# Altium schematic sheet Tx_micro.SchDoc: Balise IR-Tx - Controleur
size A3; Author: B Labbe; CompanyName: Oufffteam; DrawnBy: B Labbe; Engineer: B Labbe; Organization: Oufffteam; Address1: L3, 12a Rodborough Rd; Address2: Frenchs Forest; Address3: NSW; Address4: Australia 2086; Revision: B; SheetNumber: 1; SheetTotal: 3; DocumentName: Balise IR-Tx - Controleur
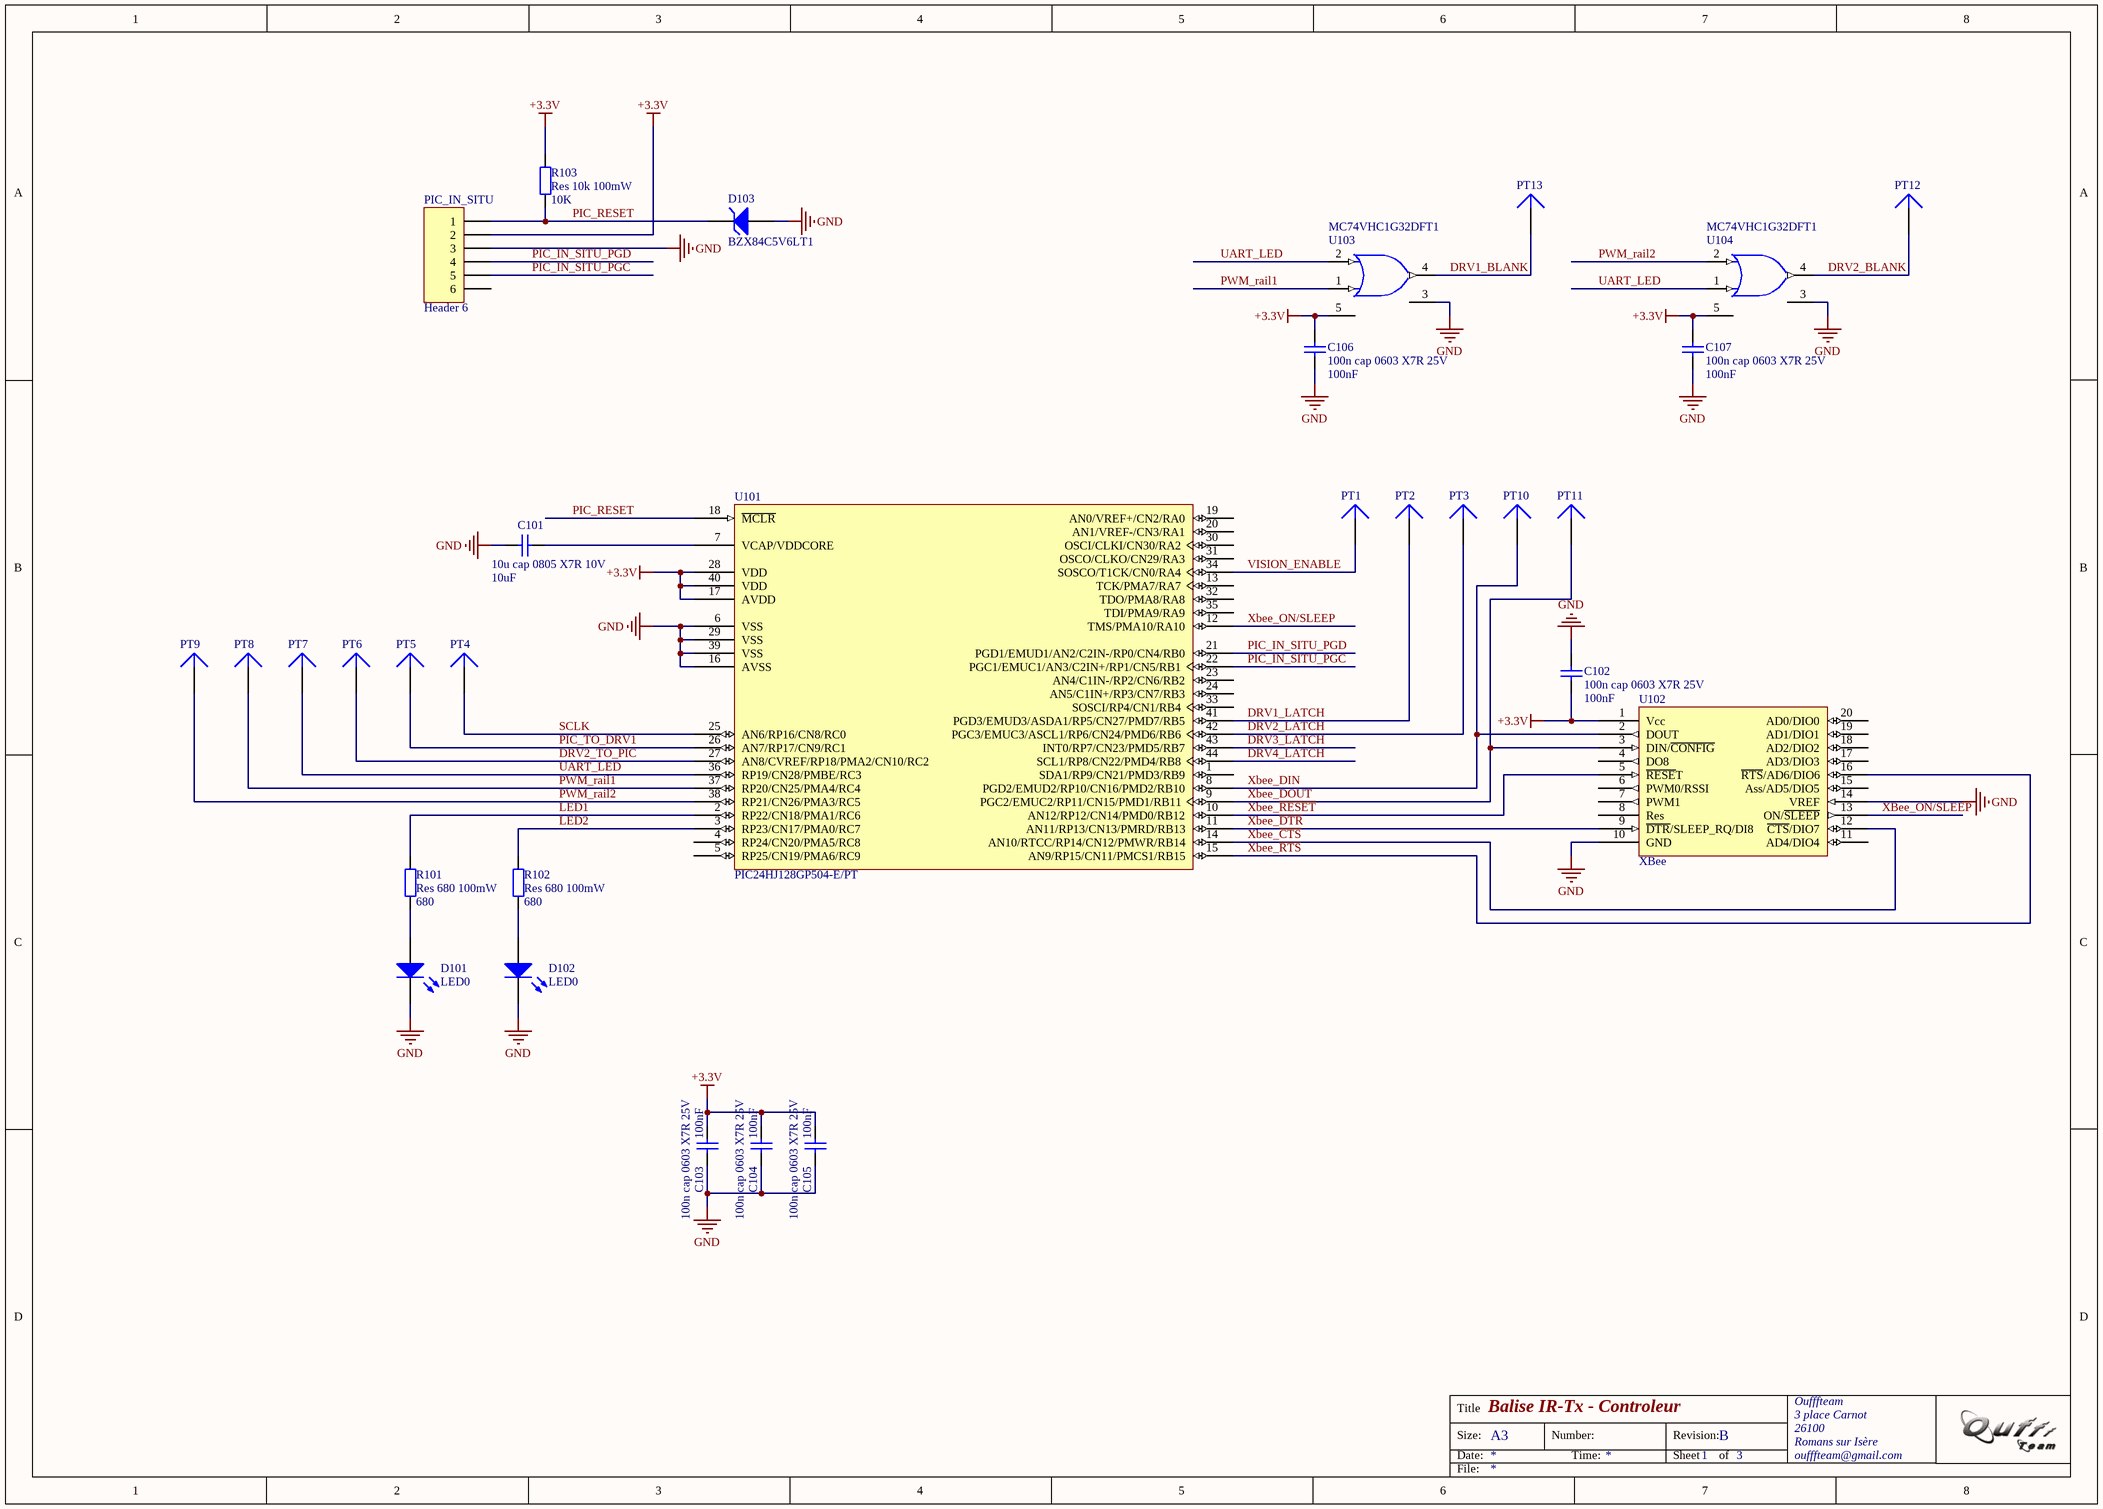
[diagram p0: Tx_micro.SchDoc]

## Parts
C101  10u cap 0805 X7R 10V  value 10uF  [0805]
C102  100n cap 0603 X7R 25V  value 100nF  [0603]
C103  100n cap 0603 X7R 25V  value 100nF  [0603]
C104  100n cap 0603 X7R 25V  value 100nF  [0603]
C105  100n cap 0603 X7R 25V  value 100nF  [0603]
C106  100n cap 0603 X7R 25V  value 100nF  [0603]
C107  100n cap 0603 X7R 25V  value 100nF  [0603]
D101  LED0  [0603]
D102  LED0  [0603]
D103  BZX84C5V6LT1  [318-07]
PIC_IN_SITU  Header 6  [HDR1X6]
PT1  Plug  [TP]  (value not drawn)
PT2  Plug  [TP]  (value not drawn)
PT3  Plug  [TP]  (value not drawn)
PT4  Plug  [TP]  (value not drawn)
PT5  Plug  [TP]  (value not drawn)
PT6  Plug  [TP]  (value not drawn)
PT7  Plug  [TP]  (value not drawn)
PT8  Plug  [TP]  (value not drawn)
PT9  Plug  [TP]  (value not drawn)
PT10  Plug  [TP]  (value not drawn)
PT11  Plug  [TP]  (value not drawn)
PT12  Plug  [TP]  (value not drawn)
PT13  Plug  [TP]  (value not drawn)
R101  Res 680 100mW  value 680  [0603]
R102  Res 680 100mW  value 680  [0603]
R103  Res 10k 100mW  value 10K  [0603]
U101  PIC24HJ128GP504-E/PT  [TQFP-PT44_L]
U102  XBee  [XBee_SM]
U103  MC74VHC1G32DFT1  [419A-01_L]
U104  MC74VHC1G32DFT1  [419A-01_L]

## Nets
+3.3V: C102.1 C103.2 C104.2 C105.2 C106.2 C107.2 PIC_IN_SITU.2 R103.2 U101.17(AVDD) U101.28(VDD) U101.40(VDD) U102.1(Vcc) U103.5(VDD) U104.5(VDD)  [also labelled VDD]
GND: C101.1 C102.2 C103.1 C104.1 C105.1 C106.1 C107.1 D101.2(K) D102.2(K) D103.1(A) PIC_IN_SITU.3 U101.6(VSS) U101.16(AVSS) U101.29(VSS) U101.39(VSS) U102.10(GND) U102.14(VREF) U103.3(GND) U104.3(GND)
DRV1_BLANK: PT13.1 U103.4(Y)
DRV1_LATCH: PT2.1 U101.41(PGD3/EMUD3/ASDA1/RP5/CN27/PMD7/RB5)
DRV2_BLANK: PT12.1 U104.4(Y)
DRV2_LATCH: PT3.1 U101.42(PGC3/EMUC3/ASCL1/RP6/CN24/PMD6/RB6)
DRV2_TO_PIC: PT6.1 U101.27(AN8/CVREF/RP18/PMA2/CN10/RC2)
DRV3_LATCH: U101.43(INT0/RP7/CN23/PMD5/RB7)
DRV4_LATCH: U101.44(SCL1/RP8/CN22/PMD4/RB8)
LED1: R101.2 U101.2(RP22/CN18/PMA1/RC6)
LED2: R102.2 U101.3(RP23/CN17/PMA0/RC7)
PIC_IN_SITU_PGC: PIC_IN_SITU.5 U101.22(PGC1/EMUC1/AN3/C2IN+/RP1/CN5/RB1)
PIC_IN_SITU_PGD: PIC_IN_SITU.4 U101.21(PGD1/EMUD1/AN2/C2IN-/RP0/CN4/RB0)
PIC_RESET: D103.3(K) PIC_IN_SITU.1 R103.1 U101.18(~{MCLR})
PIC_TO_DRV1: PT5.1 U101.26(AN7/RP17/CN9/RC1)
PWM_rail1: PT8.1 U101.37(RP20/CN25/PMA4/RC4) U103.1(IN_B)
PWM_rail2: PT9.1 U101.38(RP21/CN26/PMA3/RC5) U104.2(IN_A)
SCLK: PT4.1 U101.25(AN6/RP16/CN8/RC0)
UART_LED: PT7.1 U101.36(RP19/CN28/PMBE/RC3) U103.2(IN_A) U104.1(IN_B)
VISION_ENABLE: PT1.1 U101.34(SOSCO/T1CK/CN0/RA4)
Xbee_~{CTS}: U101.14(AN10/RTCC/RP14/CN12/PMWR/RB14) U102.12(~{CTS}/DIO7)
Xbee_~{DTR}: U101.11(AN11/RP13/CN13/PMRD/RB13) U102.9(~{DTR}/SLEEP_RQ/DI8)
Xbee_DIN: PT10.1 U101.8(PGD2/EMUD2/RP10/CN16/PMD2/RB10) U102.2(DOUT)
Xbee_DOUT: PT11.1 U101.9(PGC2/EMUC2/RP11/CN15/PMD1/RB11) U102.3(DIN/~{CONFIG})
XBee_ON/SLEEP: U101.12(TMS/PMA10/RA10) U102.13(ON/~{SLEEP})
Xbee_~{RESET}: U101.10(AN12/RP12/CN14/PMD0/RB12) U102.5(~{RESE}T)
Xbee_~{RTS}: U101.15(AN9/RP15/CN11/PMCS1/RB15) U102.16(~{RTS}/AD6/DIO6)
NetC101_2: C101.2 U101.7(VCAP/VDDCORE)
NetD101_1: D101.1(A) R101.1
NetD102_1: D102.1(A) R102.1

Not connected (* = marked no-connect by the designer): PIC_IN_SITU 6; U101 1(SDA1/RP9/CN21/PMD3/RB9) 4(RP24/CN20/PMA5/RC8) 5(RP25/CN19/PMA6/RC9) 13(TCK/PMA7/RA7) 19(AN0/VREF+/CN2/RA0) 20(AN1/VREF-/CN3/RA1) 23(AN4/C1IN-/RP2/CN6/RB2) 24(AN5/C1IN+/RP3/CN7/RB3) 30(OSCI/CLKI/CN30/RA2) 31(OSCO/CLKO/CN29/RA3) 32(TDO/PMA8/RA8) 33(SOSCI/RP4/CN1/RB4) 35(TDI/PMA9/RA9); U102 4(DO8) 6(PWM0/RSSI) 7(PWM1) 8(Res) 11(AD4/DIO4) 15(Ass/AD5/DIO5) 17(AD3/DIO3) 18(AD2/DIO2) 19(AD1/DIO1) 20(AD0/DIO0)

## Notes on the sheet
- Title
- Size:
- Date:
- A3
- Number:
- Time:
- Revision:
- Sheet
- of
- Oufffteam
- 3 place Carnot
- 26100
- Romans sur Isère
- oufffteam@gmail.com
- File:

## Library data of the parts
C101-C107 = Cap: Capacitor; Published: 8-Jun-2000; LatestRevisionDate: 17-Jul-2002; LatestRevisionNote: Re-released for DXP Platform.; PackageReference: RAD-0.3; Publisher: Altium Limited
D101 D102 = LED0: Typical INFRARED GaAs LED; Published: 8-Jun-2000; LatestRevisionDate: 08-Jul-2005; LatestRevisionNote: Mech Layer 1 removed.; PackageReference: LED-0; Publisher: Altium Limited
D103 = BZX84C5V6LT1: Zener Voltage Regulator Diode; Note: Pin 2 is not connected and not drawn.; Published: 29-Sep-2000; LatestRevisionDate: 17-Jul-2002; LatestRevisionNote: Re-released for DXP Platform.; PackageReference: 318-07; Publisher: Altium Limited; PackageDescription: SOT-23; 3 Leads; Body 3.0 x 2.5 mm, inc. leads (LxW max); ComponentLink1Description: Manufacturer Link; ComponentLink1URL: http://www.onsemi.com/site/products/landing?taxonomyID=194; ComponentLink2Description: Datasheet; ComponentLink2URL: http://www.onsemi.com/pub/Collateral/BZX84C2V4LT1-D.PDF
PIC_IN_SITU = Header 6: Header, 6-Pin; LatestRevisionDate: 17-Jul-2002; LatestRevisionNote: Re-released for DXP Platform.; Publisher: Altium Limited
R101-R103 = Res2: Resistor; Published: 8-Jun-2000; LatestRevisionDate: 17-Jul-2002; LatestRevisionNote: Re-released for DXP Platform.; PackageReference: AXIAL-0.4; Publisher: Altium Limited
U101 = PIC24HJ128GP504-E/PT: High Speed General Purpose 16-Bit Flash Microcontroller, 128KB Flash, 8KB RAM, 44-Pin TQFP, Extended Temperature; Published: 29-Jan-2009; DatasheetVersion: revB, Mar-2008; PackageVersion: revAW, Oct-2008; PackageReference: TQFP-PT44; Publisher: Altium Limited; PackageDescription: 44-Lead Plastic Thin Quad Flatpack (PT) - 10x10x1mm Body, 2.00mm [TQFP]; Code_JEDEC: MS-026; ComponentLink1Description: Manufacturer Link; ComponentLink1URL: http://www.microchip.com; ComponentLink2Description: Datasheet; ComponentLink2URL: http://ww1.microchip.com/downloads/en/DeviceDoc/70293B.pdf; ComponentLink3Description: Packaging Specification; ComponentLink3URL: http://ww1.microchip.com/downloads/en/PackagingSpec/00049AW.pdf
U102 = XBee: OEM RF Modules
U103 U104 = MC74VHC1G32DFT1: 2-Input OR Gate; Published: 15-Apr-2002; LatestRevisionDate: 12-Dec-2006; LatestRevisionNote: IPC-7351 Footprint Added.; DatasheetVersion: Dec-1999; PackageVersion: Oct-1999; PackageReference: 419A-01; Publisher: Altium Limited; PackageDescription: 5-Pin SOT-353 Package 0.65 mm Pitch, 2.1 mm Lead Span; ComponentLink1Description: Manufacturer Link; ComponentLink1URL: http://www.onsemi.com/; ComponentLink2Description: Datasheet; ComponentLink2URL: http://www.onsemi.com/pub/Collateral/MC74VHC1G32.PDF
PT1-PT13 = Plug: LatestRevisionDate: 17-Jul-2002; LatestRevisionNote: Re-released for DXP Platform.; Publisher: Altium Limited